# Altium schematic sheet RTC.SchDoc: Iris
size A3; Organization: Toradex AG; Address1: Altsagenstrasse 5; Address2: Horw; Address3: 6048; Address4: Switzerland; DocumentNumber: 8; Revision: V2.0; SheetNumber: 8; SheetTotal: 16
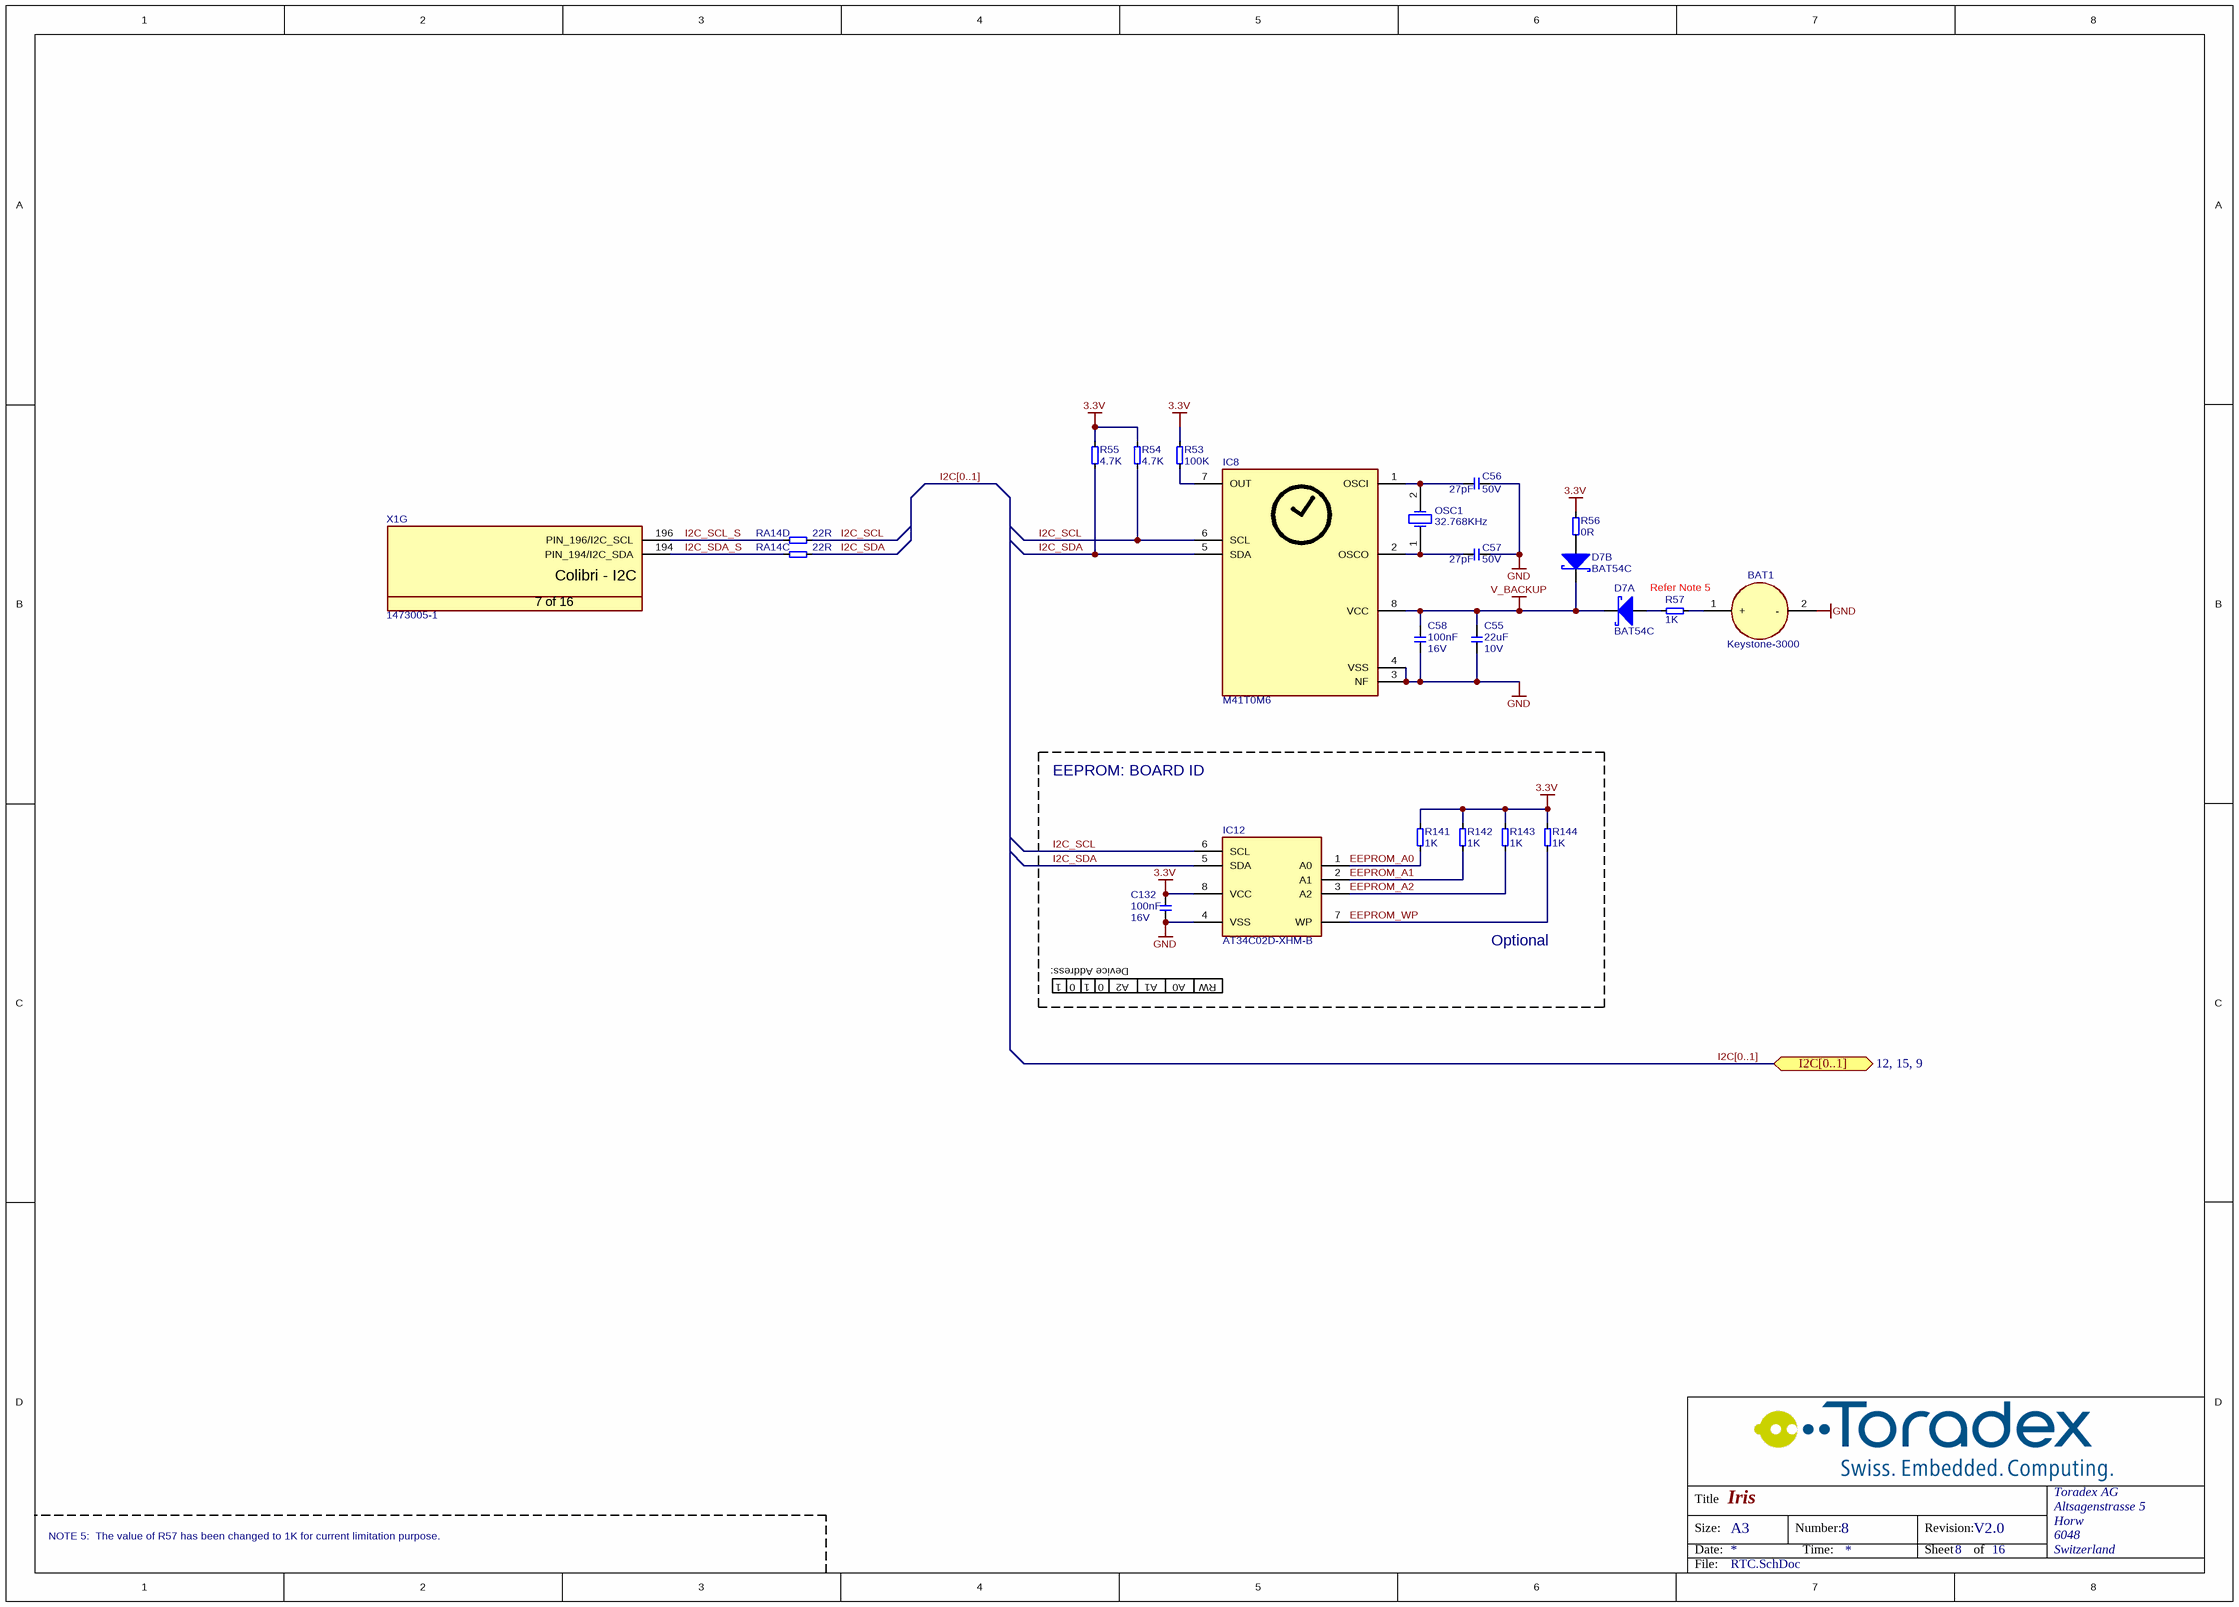
[diagram p0: RTC.SchDoc]

## Parts
BAT1  Keystone-3000  [T_Keystone_3000]
C55  Rating: 10V  [T_CAPC0805X125N]  (hidden comment: 22uF)
C56  Rating: 50V  [T_CAPC0603X33N]  (hidden comment: 27pF)
C57  Rating: 50V  [T_CAPC0603X33N]  (hidden comment: 27pF)
C58  Rating: 16V  [CAPC1005X60N]  (hidden comment: 100nF)
C132  Rating: 16V  [CAPC1005X60N]  (hidden comment: 100nF)
D7  BAT54C  [SOT95P230X110-3N]  (parts A,B of 2)
IC8  M41T0M6  [SOIC127P600X173-8N]
IC12  AT34C02D-XHM-B  [TSOP65P650X120-8M]
OSC1  value 32.768KHz  [T_MC_CC4V-T1A]  (hidden comment: CC4V-T1A)
R53  100K  [T_RESC0603X30N]
R54  4.7K  [RESC1005X40N]
R55  4.7K  [RESC1005X40N]
R56  0R  [T_RESC0603X30N]
R57  1K  [RESC1005X40N]
R141  1K  [T_RESC0603X30N]
R142  1K  [T_RESC0603X30N]
R143  1K  [T_RESC0603X30N]
R144  1K  [T_RESC0603X30N]
RA14  22R  [T_Resistor_Array_X4]  (parts C,D of 4)
X1  1473005-1  [T_Tyco_1473005-1]  (part G of 16)

## Ports
I2C[0..1] (bidir, see 12, 15, 9)

## Nets
3.3V: C132.2 IC12.8(VCC) R53.2 R54.2 R55.2 R56.2 R141.2 R142.2 R143.2 R144.2
GND: BAT1.2(-) C55.1 C56.1 C57.1 C58.1 C132.1 IC8.3(NF) IC8.4(VSS) IC12.4(VSS)
V_BACKUP: C55.2 C58.2 D7.3 IC8.8(VCC)
EEPROM_A0: IC12.1(A0) R141.1
EEPROM_A1: IC12.2(A1) R142.1
EEPROM_A2: IC12.3(A2) R143.1
EEPROM_WP: IC12.7(WP) R144.1
I2C_SCL: IC8.6(SCL) IC12.6(SCL) R54.1 RA14.8
I2C_SCL_S: RA14.4 X1.196(PIN_196/I2C_SCL)
I2C_SDA: IC8.5(SDA) IC12.5(SDA) R55.1 RA14.7
I2C_SDA_S: RA14.3 X1.194(PIN_194/I2C_SDA)
NetBAT1_1: BAT1.1(+) R57.1
NetC56_2: C56.2 IC8.1(OSCI) OSC1.2(OSC2)
NetC57_2: C57.2 IC8.2(OSCO) OSC1.1(OSC1)
NetD7_1: D7.1 R57.2
NetD7_2: D7.2 R56.1
NetIC8_7: IC8.7(OUT) R53.1

## Buses and harness runs
bus I2C[0..1] = port I2C[0..1]

## Notes on the sheet
- Refer Note 5
- EEPROM: BOARD ID
- 1
- 0
- Device Address:
- A2
- A1
- A0
- RW
- Optional
- NOTE 5:  The value of R57 has been changed to 1K for current limitation purpose.
- Title
- Size:
- Date:
- A3
- Number:
- Time:
- Revision:
- Sheet
- of
- File:
- (in symbol CON-Tyco-1473005-1-200-0.6mm, part G) Colibri - I2C; 7 of 16

## Library data of the parts
BAT1 = BAT-Keystone-3000: Battery Holder; Manufacturer Part No.: 3000; Manufacturer Name: Keystone
C55 = C-X5R-22uF-10V-20%-0805: Capacitor Ceramic X5R 22uF 10V 20% 0805; Tolerance: 20%; Type: X5R; Value: 22uF
C56 C57 = C-NPO-27pF-50V-5%-0603: Capacitor Ceramic NPO 27pF 50V 5% 0603; Tolerance: 5%; Type: NPO; Value: 27pF
C58 C132 = C-X7R-100nF-16V-10%-0402: Capacitor Ceramic X7R 100nF 16V 10% 0402; Tolerance: 10%; Type: X7R; Value: 100nF
D7 = D-Philips-BAT54C-Schottky: BAT54C Schottky Diode; Manufacturer Name: Philips; Manufacturer Part No.: BAT54C
IC8 = IC-ST-M41T0M6: RTC M41T0M6; Manufacturer Name: ST; Manufacturer Part No.: M41T0M6
IC12 = IC-Microchip-AT34C02D-XHM-B: EEPROM, 2Kbit (256 x 8), TSSOP-8 package; Manufacturer Name: Microchip; Manufacturer Part No.: AT34C02D-XHM-B
OSC1 = OSC-MC-CC4V-T1A-32.768KHz-30ppm-5x1.9mm: Quartz 32.768kHz; Manufacturer Name: Micro Crystal; Tolerance: 30ppm; Manufacturer Part No.: CC4V-T1A
R53 = R-100KR-63mW-5%-0603: Resistor 100 Kohm 63mW 5% 0603; Value: 100KR; Rating: 63mW; Tolerance: 5%
R54 R55 = R-4.7kR-63mW-5%-0402: Resistor 4.7 Kohm 63mW 5% 0402; Value: 4.7KR; Rating: 63mW; Tolerance: 5%
R56 = R-0R-63mW-5%-0603: Resistor 0 ohm 63mW 5% 0603; Rating: 63mW; Tolerance: 5%; Value: 0R; Size: 0603 (In)
R57 = R-1KR-63mW-5%-0402: Resistor 1 Kohm 63mW 5% 0402; Rating: 63mW; Tolerance: 5%; Value: 1K
R141-R144 = R-1KR-63mW-5%-0603: Resistor 1 Kohm 63mW 5% 0603; Rating: 63mW; Tolerance: 5%; Value: 1K
RA14 = RA-22R-63mW-5%-1206-div: Resistor Array 22 R 63mW 5% 1206; Manufacturer Name: Generic; Tolerance: 5%; Power Dissipation: 63mW; Manufacturer Part Number: *; Value: 22R
X1 = CON-Tyco-1473005-1-200-0.6mm: SODIMM Connector; Manufacturer Name: Tyco; No. of ways: 200; Manufacturer Part No.: 1473005-1